# EAGLE design door_lock_2 (EAGLE 7.6.0)
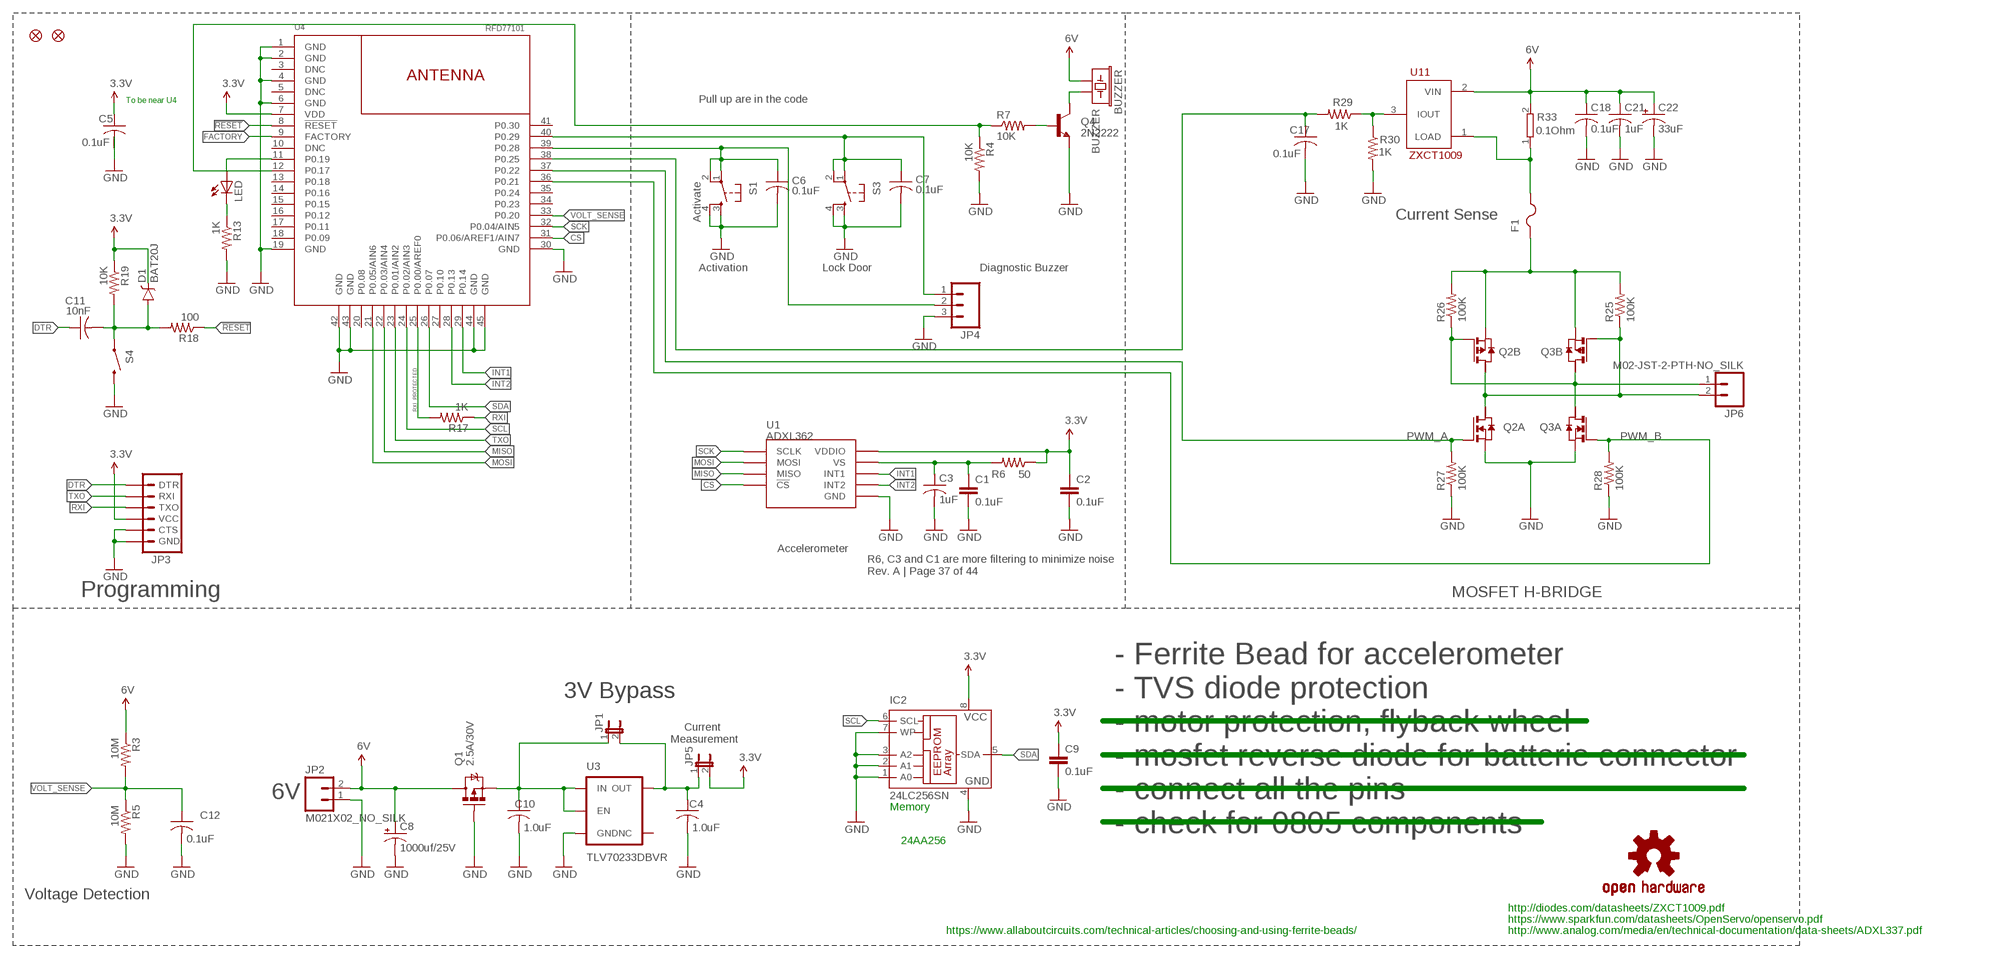
[diagram p0: schematic, sheet 1]

## Parts
BUZZER  BUZZER  BUZZERNS  [BUZZER-12MM-NS]
C1  0.1uF  CAP0805  [0805]
C2  0.1uF  CAP0805  [0805]
C3  1uF  C-USC0805  [C0805]
C4  1.0uF  C-USC0805  [C0805]
C5  0.1uF  C-USC0805  [C0805]
C6  0.1uF  C-USC0805  [C0805]
C7  0.1uF  C-USC0805  [C0805]
C8  1000uf/25V  1000UF-25V(PTH)KIT  [CPOL-RADIAL-1000UF-25V-KIT]
C9  0.1uF  CAP0805  [0805]
C10  1.0uF  C-USC0805  [C0805]
C11  10nF  C-USC0805  [C0805]
C12  0.1uF  C-USC0805  [C0805]
C17  0.1uF  C-USC0805  [C0805]
C18  0.1uF  C-USC0805  [C0805]
C21  1uF  C-USC0805  [C0805]
C22  33uF  CAP_POL3528  [EIA3528]
D1  BAT20J  DIODE-SCHOTTKY-BAT20J  [SOD-323]
F1  PTCFUSE-1812  [1812]
IC2  24LC256SN  [SO-08]
JP1  JUMPER-2SMD-NO  [SJ_2S-NO]
JP2  M021X02_NO_SILK  [1X02_NO_SILK]
JP3  ARDUINO_SERIAL_PROGRAMPTH  [1X06]
JP4  M03PTH  [1X03]
JP5  JUMPER-2PTH  [1X02]
JP6  M02-JST-2-PTH-NO_SILK  [JST-2-PTH-NS]
JP9  FIDUCIALUFIDUCIAL  [MICRO-FIDUCIAL]
JP10  FIDUCIALUFIDUCIAL  [MICRO-FIDUCIAL]
LED  LEDCHIP-LED0805  [CHIP-LED0805]
Q1  2.5A/30V  MOSFET-PCHANNELDMG2307L  [SOT23-3]
Q2  PN_MOSFET-SO8  [SO8]
Q3  PN_MOSFET-SO8  [SO8]
Q4  2N2222  TRANSISTOR_NPNSOT23  [SOT23]
R3  10M  R-US_R0805  [R0805]
R4  10K  R-US_R0805  [R0805]
R5  10M  R-US_R0805  [R0805]
R6  50  R-US_R0805  [R0805]
R7  10K  R-US_R0805  [R0805]
R13  1K  R-US_R0805  [R0805]
R17  1K  R-US_R0805  [R0805]
R18  100  R-US_R0805  [R0805]
R19  10K  R-US_R0805  [R0805]
R25  100K  R-US_R0805  [R0805]
R26  100K  R-US_R0805  [R0805]
R27  100K  R-US_R0805  [R0805]
R28  100K  R-US_R0805  [R0805]
R29  1K  R-US_R0805  [R0805]
R30  1K  R-US_R0805  [R0805]
R33  0.1Ohm  R1206W  [R1206W]
S1  Activate  TAC_SWITCHPTH  [TACTILE-PTH]
S3  TAC_SWITCHPTH  [TACTILE-PTH]
S4  SWITCH-MOMENTARY-2SMD  [TACTILE-SWITCH-SMD]
U1  ADXL362  [ADXL362]
U3  TLV70233DBVR  V_REG_AP2112K-3.3V  [SOT23-5]
U4  RFD77101  [RFD77101]
U11  ZXCT1009  ZCT1009FTA  [SOT23-3]
U$3  OSHW-LOGOS  [OSHW-LOGO-S]

## Nets
3.3V: C2.1 C5.1 C9.1 D1.C IC2.8(VCC) JP3.4(VCC) JP5.2 R6.1 R19.1 U1.P$1(VDDIO) U4.7(VDD)
6V: BUZZER.+ C8.+ C18.1 C21.1 C22.A(+) JP2.2 Q1.3(D) R3.1 R33.2 U11.2(VIN)
!RESET: R18.1 U4.8(!RESET!)
ACTIVATE: C6.1 JP4.2 S1.1 S1.2 U4.39(P0.28)
BUZZER: R4.1 R7.1 U4.12(P0.17)
CS: U1.P$8(!CS) U4.31(P0.06/AREF1/AIN7)
CURSENSE: C17.1 R29.2 U4.38(P0.25)
DTR: C11.1 JP3.1(DTR)
FACTORY: U4.9(FACTORY)
GND: C1.2 C2.2 C3.2 C4.2 C5.2 C6.2 C7.2 C8.- C9.2 C10.2 C12.2 C17.2 C18.2 C21.2 C22.C(-) IC2.1(A0) IC2.2(A1) IC2.3(A2) IC2.4(GND) IC2.7(WP) JP2.1 JP3.5(CTS) JP3.6(GND) JP4.3 Q1.1(G) Q2.1(A:S) Q3.1(A:S) Q4.2(E) R4.2 R5.2 R13.2 R27.1 R28.1 R30.2 S1.3 S1.4 S3.3 S3.4 S4.3 U1.P$12(GND) U1.P$13(GND) U1.P$16(GND) U3.2(GND) U4.1(GND) U4.2(GND) U4.4(GND) U4.6(GND) U4.19(GND) U4.30(GND) U4.42(GND) U4.43(GND) U4.44(GND) U4.45(GND)
INT1: U1.P$11(INT1) U4.29(P0.14)
INT2: U1.P$9(INT2) U4.28(P0.13)
LOCK: C7.1 JP4.1 S3.1 S3.2 U4.40(P0.29)
MISO: U1.P$7(MISO) U4.22(P0.03/AIN4)
MOSI: U1.P$6(MOSI) U4.21(P0.05/AIN6)
MOTOR_OUT_A: JP6.1 Q2.4(B:G) Q3.5(B:D) Q3.7(A:D) R26.1
MOTOR_OUT_B: JP6.2 Q2.5(B:D) Q2.7(A:D) Q3.4(B:G) R25.1
N$2: C4.1 JP1.2 JP5.1 U3.5(OUT)
N$3: F1.2 R33.1 U11.1(LOAD)
N$7: C1.1 C3.1 R6.2 U1.P$14(VS)
N$8: Q4.1(B) R7.2
N$10: BUZZER.- Q4.3(C)
N$13: C11.2 D1.A R18.2 R19.2 S4.1
N$15: LED.C R13.1
N$47: F1.1 Q2.3(B:S) Q3.3(B:S) R25.2 R26.2
N$48: R29.1 R30.1 U11.3(IOUT)
P0.10: LED.A U4.11(P0.19)
PWM_A: Q2.2(A:G) R27.2 U4.37(P0.22)
PWM_B: Q3.2(A:G) R28.2 U4.36(P0.21)
RXI: JP3.3(TXO) R17.1
RXI_PROTECTED: R17.2 U4.25(P0.00/AREF0)
SCK: U1.P$4(SCLK) U4.32(P0.04/AIN5)
SCL: IC2.6(SCL) U4.24(P0.02/AIN3)
SDA: IC2.5(SDA) U4.26(P0.07)
TXO: JP3.2(RXI) U4.23(P0.01/AIN2)
VIN1: C10.1 JP1.1 Q1.2(S) U3.1(IN) U3.3(EN)
VOLT_SENSE: C12.1 R3.2 R5.1 U4.33(P0.20)
Unconnected: Q2.6(B:D2) Q2.8(A:D2) Q3.6(B:D2) Q3.8(A:D2) U3.4(NC) U4.3(DNC) U4.5(DNC) U4.10(DNC) U4.13(P0.18) U4.14(P0.16) U4.15(P0.15) U4.16(P0.12) U4.17(P0.11) U4.18(P0.09) U4.20(P0.08) U4.27(P0.10) U4.34(P0.23) U4.35(P0.24) U4.41(P0.30)

## Notes on the sheet
- To be near U4 | Pull up are in the code
- Current Sense
- Activation | Lock Door | Diagnostic Buzzer
- Accelerometer
- R6, C3 and C1 are more filtering to minimize noise
  Rev. A | Page 37 of 44
- Programming | MOSFET H-BRIDGE
- 3V Bypass
- Current 
  Measurement
- 6V
- Memory
- 24AA256
- Voltage Detection
- - Ferrite Bead for accelerometer
  - TVS diode protection
  - motor protection, flyback wheel
  - mosfet reverse diode for batterie connector
  - connect all the pins
  - check for 0805 components
- http://diodes.com/datasheets/ZXCT1009.pdf
- https://www.sparkfun.com/datasheets/OpenServo/openservo.pdf
- https://www.allaboutcircuits.com/technical-articles/choosing-and-using-ferrite-beads/ | http://www.analog.com/media/en/technical-documentation/data-sheets/ADXL337.pdf

## Library data of the parts
BUZZER = SparkFun-Electromechanical:BUZZER: Buzzer 12mm Spark Fun Electronics SKU : Comp-Buzzer
C1 C2 C9 = SparkFun-Capacitors:CAP: Capacitor Standard 0603 ceramic capacitor, and 0.1" leaded capacitor.
C3-C7 C10-C12 C17 C18 C21 = rcl:C-US: CAPACITOR, American symbol
C8 = SparkFun-Capacitors:1000UF-25V(PTH): CAP-08070; PROD_ID: CAP-09538
C22 = SparkFun:CAP_POL: Capacitor Polarized These are standard SMD and PTH capacitors. Normally 10uF, 47uF, and 100uF in electrolytic and tantalum varieties. Always verify the external diameter of the through hole cap, it varies with capacity, voltage, and manufacturer. The EIA devices should be standard.
D1 = SparkFun-DiscreteSemi:DIODE-SCHOTTKY: Schottky diodes in SFE's production catalog BAT20J 1A 23V 0.62Vf RB751 120mA 40V 0.37Vf PMEG4005EJ 0.5A 40V 0.42Vf MBRA140 1A 40V 0.5Vf B340A 3A 40V SMA; PROD_ID: DIO-11623
F1 = adafruit:PTCFUSE: PTC fuses, resettable thermistors
IC2 = microchip:24*: Serial EEPROM I2C; MF: MICROCHIP; MPN: 24LC256-I/SN; OC_FARNELL: 9757996; OC_NEWARK: 27C9144
JP1 = SparkFun-Retired:JUMPER-2: Jumper Basic 0.1" spaced jumper. Use with breakaway headers.
JP2 JP6 = SparkFun-Connectors:M02: Standard 2-pin 0.1" header. Use with - straight break away headers ( PRT-00116) - right angle break away headers (PRT-00553) - swiss pins (PRT-00743) - machine pins (PRT-00117) - female headers (PRT-00115) Molex polarized connector foot print use with: PRT-08233 with associated crimp pins and housings. 2.54_SCREWTERM for use with PRT-10571. 3.5mm Screw Terminal footprints for PRT-08084 5mm Screw Terminal footprints for use with PRT-08432
JP3 = SparkFun-Connectors:ARDUINO_SERIAL_PROGRAM: FTDI connector footprints
JP4 = SparkFun-Connectors:M03: Header 3 Standard 3-pin 0.1" header. Use with straight break away headers (SKU : PRT-00116), right angle break away headers (PRT-00553), swiss pins (PRT-00743), machine pins (PRT-00117), and female headers (PRT-00115). Molex polarized connector foot print use with SKU : PRT-08232 with associated crimp pins and housings.
JP5 = SparkFun-Passives:JUMPER-2: Jumper Basic 0.1" spaced jumper. Use with breakaway headers.
JP9 JP10 = SparkFun:FIDUCIAL: Fiducial Alignment Points Various fiducial points for machine vision alignment.
LED = adafruit:LED: LED OSRAM: - CHIPLED LG R971, LG N971, LY N971, LG Q971, LY Q971, LO R971, LY R971 LH N974, LH R974 LS Q976, LO Q976, LY Q976 LO Q996 - Hyper CHIPLED LW Q18S LB Q993, LB Q99A, LB R99A - SideLED LS A670, LO A670, LY A670, LG A670, LP A670 LB A673, LV A673, LT A673, LW A673 LH A674 LY A675 LS A676, LA A676, LO A676, LY A676, LW A676 LS A679, LY A679, LG A679 - Hyper Micro SIDELED® LS Y876, LA Y876, LO Y876, LY Y876 LT Y87S - SmartLED LW L88C, LW L88S LB L89C, LB L89S, LG L890 LS L89K, LO L89K, LY L89K LS L896, LA L896, LO L896, LY L896 - TOPLED LS T670, LO T670, LY T670, LG T670, LP T670 LSG T670, LSP T670, LSY T670, LOP T670, LYG T670 LG T671, LOG T671, LSG T671 LB T673, LV T673, LT T673, LW T673 LH T674 LS T676, LA T676, LO T676, LY T676, LB T676, LH T676, LSB T676, LW T676 LB T67C, LV T67C, LT T67C, LS T67K, LO T67K, LY T67K, LW E67C LS E67B, LA E67B, LO E67B, LY E67B, LB E67C, LV E67C, LT E67C LW T67C LS T679, LY T679, LG T679 LS T770, LO T770, LY T770, LG T770, LP T770 LB T773, LV T773, LT T773, LW T773 LH T774 LS E675, LA E675, LY E675, LS T675 LS T776, LA T776, LO T776, LY T776, LB T776 LHGB T686 LT T68C, LB T68C - Hyper Mini TOPLED® LB M676 - Mini TOPLED Santana® LG M470 LS M47K, LO M47K, LY M47K Source: http://www.osram.convergy.de/
Q1 = SparkFun-DiscreteSemi:MOSFET-PCHANNEL: Generic PMOSFET IRLML2244 - TRANS-11153 (SOT-23 -20V -4.3A) (1.Gate 2.Source 3.Drain) FQP27P06 - COM-10349 <http://www.sparkfun.com/products/10349> (TO-220 -60V -27A) (1.Gate 2.Source 3.Drain); PROD_ID: TRANS-11308
Q2 Q3 = zetex:PN_MOSFET-: DUAL N AND P-CHANNEL ENHANCEMENT MODE MOSFET source ZXMD63C02.pdf from http://www.zetex.com/
Q4 = SparkFun-DiscreteSemi:TRANSISTOR_NPN: Generic NPN BJT MMBT2222A - TRANS-08049 (SOT-23, 1A 40V) MPSA42 - TRANS-09116 (SOT-23, 500mA 300V) MMBT5088LT1G - TRANS-11160 (SOT-23, 50 mA 30V) BC547 - COM-08928 <http://www.sparkfun.com/products/8928> (TO-92 45V 100mA) (1.Collector 2.Base 3.Emitter) 2N3904 - COM-00521 <http://www.sparkfun.com/products/521> (TO-92 40V 200mA) (1.Emitter 2.Base 3.Collector) P2N2222A - COM-12852 <http://www.sparkfun.com/products/12852> (TO-92 40V 600mA) (1.Collector 2.Base 3.Emitter)
R3-R7 R13 R17-R19 R25-R30 = rcl:R-US_: RESISTOR, American symbol
R33 = openservo:R1206W
S1 S3 = SparkFun-Electromechanical:TAC_SWITCH: Momentary Switch Button commonly used for reset or general input. Spark Fun Electronics SKU : COM-00097 SMT- SWCH-08247
S4 = SparkFun-Electromechanical:SWITCH-MOMENTARY-2: Various NO switches- pushbuttons, reed, etc
U1 = SparkFun-Sensors:ADXL362: Micropower 3-axis accelerometer 2/4/8g digital output (SPI) IC-11297; PROD_ID: IC-11297
U3 = SparkFun-PowerIC:V_REG_AP2112: AP2112 - 600mA CMOS LDO Regulator w/ Enable The AP2112 is CMOS process low dropout linear regulator with enable function, the regulator delivers a guaranteed 600mA (min.) continuous load current. Features Output Voltage Accuracy: ±1.5% Output Current: 600mA (Min.) Foldback Short Current Protection: 50mA Enable Function to Turn ON/OFF VOUT Low Dropout Voltage (3.3V): 250mV (Typ.) @IOUT=600mA Excellent Load Regulation: 0.2%/A (Typ.) Excellent Line Regulation: 0.02%/V (Typ.) Low Quiescent Current: 55μA (Typ.) Low Standby Current: 0.01μA (Typ.) Low Output Noise: 50μVRMS PSRR: 100Hz -65dB, 1kHz -65dB OTSD Protection Stable with 1.0μF Flexible Cap: Ceramic, Tantalum and Aluminum Electrolytic Operation Temperature Range: -40°C to 85°C ESD: MM 400V, HBM 4000V; PROD_ID: VREG-12457; VALUE: 3.3V
U4 = RFDigital:RFD77101: Simblee ™ BLE Module RFD77101 © 2015 RF Digital Corporation www.RFDigital.com www.Simblee.com PATENTS PENDING 04.01.2015; PROD_ID: COMP-13017
U11 = SparkFun:ZCT1009FTA
U$3 = SparkFun:OSHW-LOGO: Open Source Hardware Logo This logo indicates the piece of hardware it is found on incorporates a OSHW license and/or adheres to the definition of open source hardware found here: http://freedomdefined.org/OSHW

## Net classes
1 vcc: width 0.254 mm

## Board
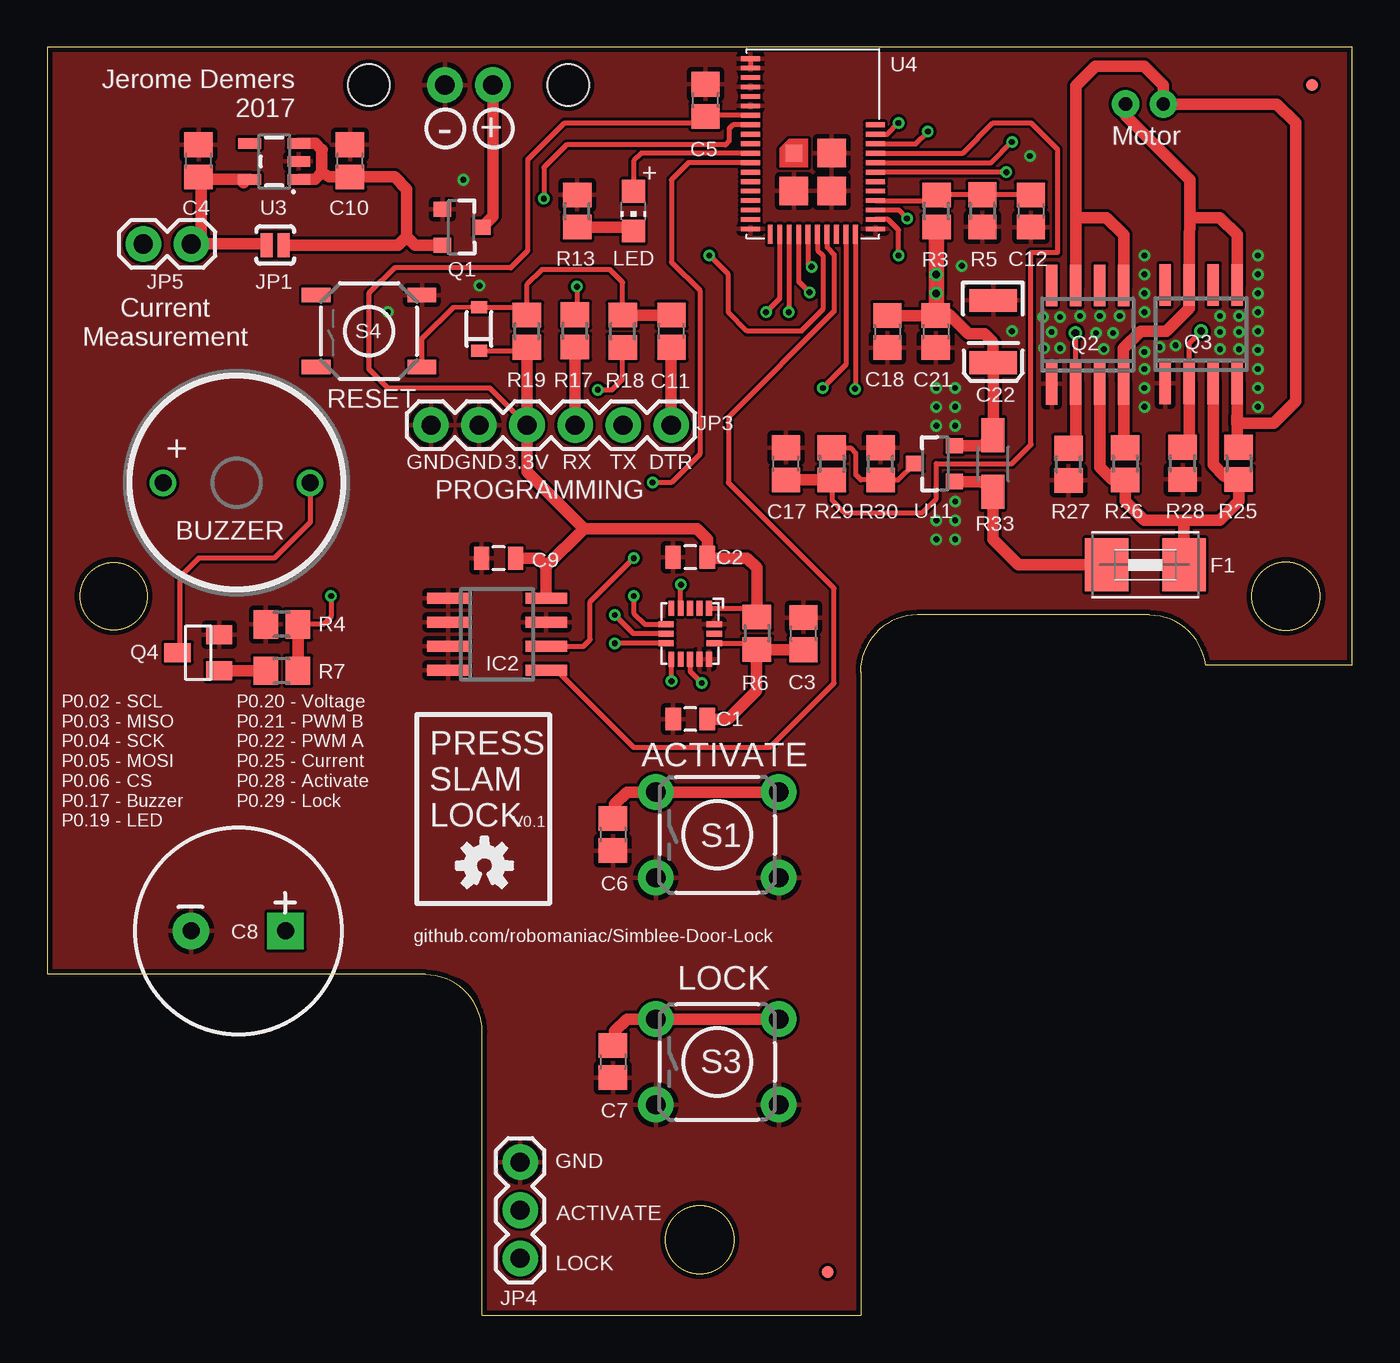
[diagram p1: board, top side]
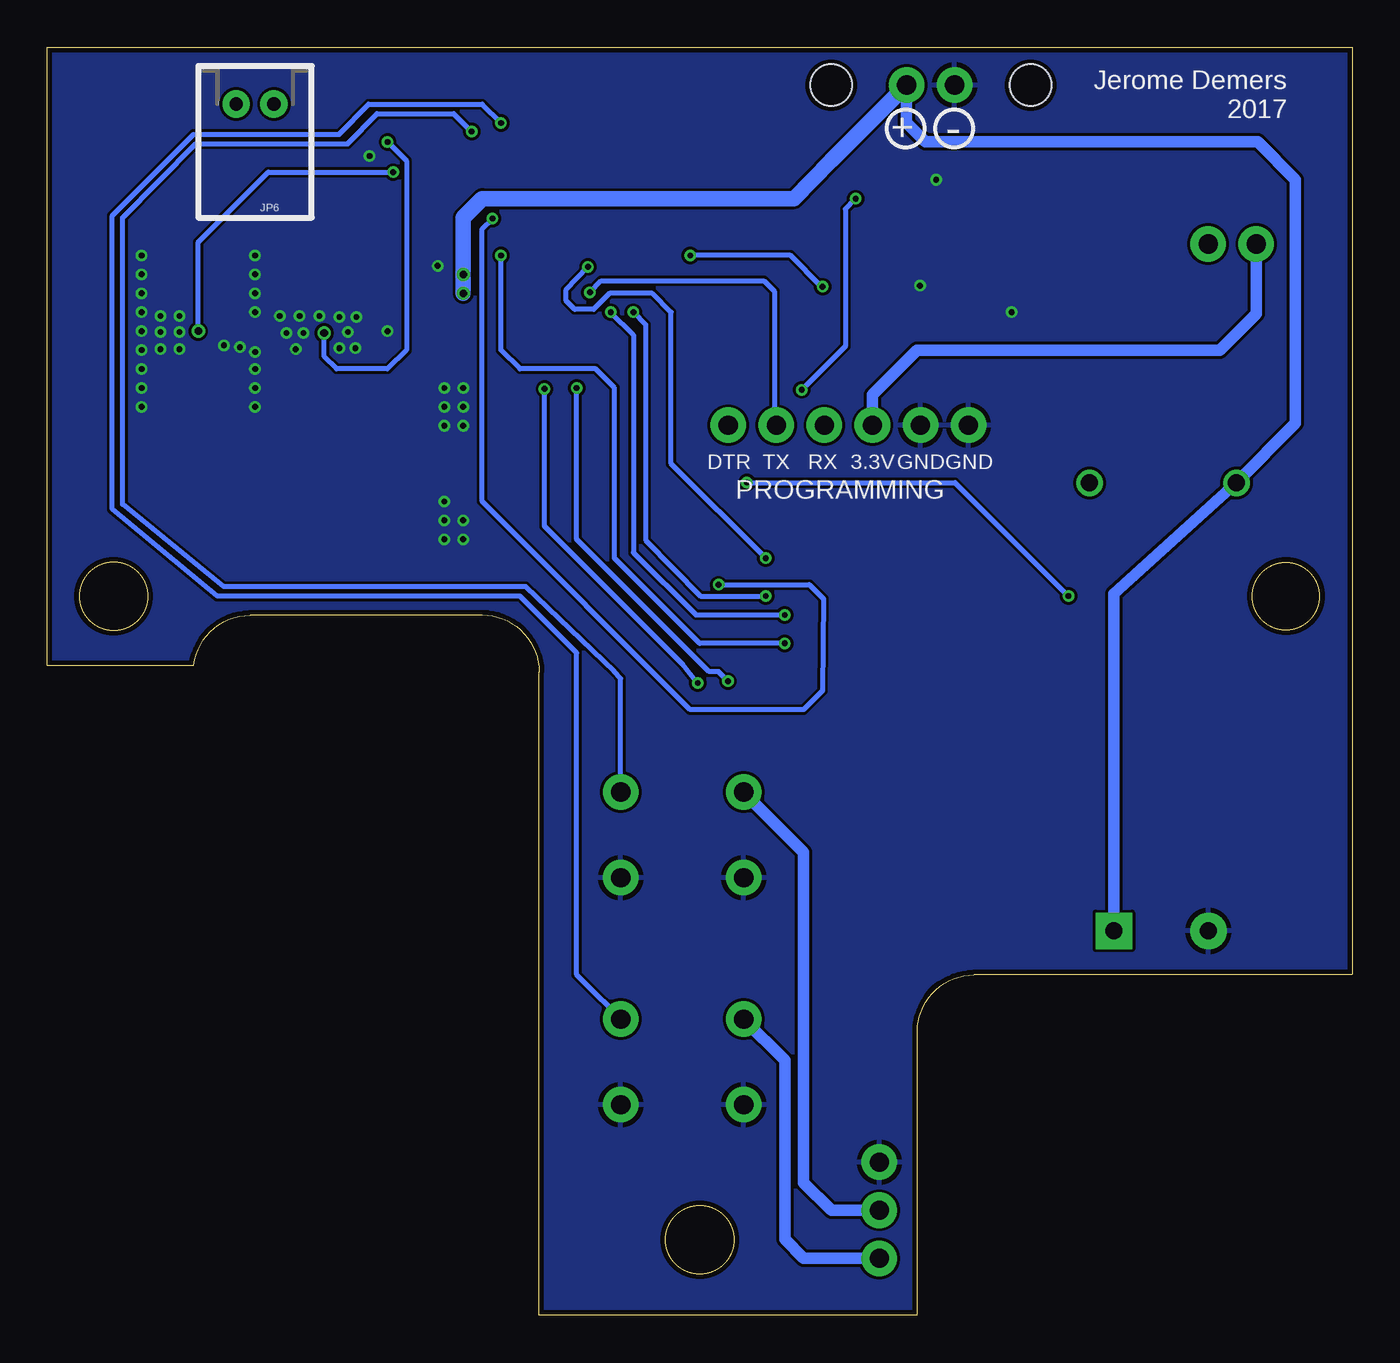
[diagram p2: board, bottom side, seen from below]

Size 68.99 x 67.01 mm. Coordinates in mm from the lower left corner, seen from the top.
Outline: 43,33.99 43,0 22.99,0 22.99,14.99 arc90 19.99,17.98
Outline: 42.99,33.99 arc-90 46,37.01 58.27,37.01
Outline: 58.27,36.99 arc-83 61.24,34.34 68.99,34.34 68.99,67.01 0,67.01 0,18.01 19.99,18.01
Outline: circle at 34.49,3.99 radius 1.8
Outline: circle at 65.48,38 radius 1.8
Outline: circle at 3.51,38 radius 1.78
Copper layers (1*16): Top 0.035mm / dielectric 1.5mm / Bottom 0.035mm
Design rules "SeeedStudio_2layer_DRU_no_angle_20140221": minimum track width 6mil, minimum drill 12mil, track to track 6mil, track to pad 6mil, pad to pad 6mil, via to via 6mil, smd to smd 0mil, copper to edge 10mil, drill to drill 10mil, minimum pad ring 10mil, minimum via ring 6mil, stop-mask expansion 2mil, vias tented up to drill 100mil, thermal gap 10mil
Holes 2.2 mm at 17,65.01 27.55,65.01

### Footprints (pad centres in the part's own frame; a part is rotated, then mirrored left to right if it is on the bottom)
BUZZER-12MM-NS = drill 0.9: + 3.885,0; - -3.885,0
0805 = smd 0.8 x 1.2: 1 -0.9,0; 2 0.9,0
C0805 = smd 1.3 x 1.5: 1 -0.85,0; 2 0.85,0
CPOL-RADIAL-1000UF-25V-KIT = drill 0.9 pad 1.93 square: + 2.5,0 | drill 0.9 pad 1.93: - -2.5,0
EIA3528 = smd 1.2 x 2.5: A 1.65,0; C -1.65,0
SOD-323 = smd 0.63 x 0.83: A 1.15,0; C -1.15,0
1812 = smd 2.286 x 2.794: 1 -2.046,0; 2 2.046,0
SO-08 = smd 0.6 x 2.2: 1 -1.905,-2.6; 2 -0.635,-2.6; 3 0.635,-2.6; 4 1.905,-2.6; 5 1.905,2.6; 6 0.635,2.6; 7 -0.635,2.6; 8 -1.905,2.6
SJ_2S-NO = smd 0.635 x 1.27: 1 -0.45,0; 2 0.45,0
1X02_NO_SILK = drill 1.016 pad 1.88: 1 0,0; 2 2.54,0
1X06 = drill 1.016 pad 1.88: 1 0,0; 2 2.54,0; 3 5.08,0; 4 7.62,0; 5 10.16,0; 6 12.7,0
1X03 = drill 1.016 pad 1.88: 1 0,0; 2 2.54,0; 3 5.08,0
1X02 = drill 1.016 pad 1.88: 1 0,0; 2 2.54,0
JST-2-PTH-NS = drill 0.7 pad 1.448: 1 -1,0; 2 1,0
MICRO-FIDUCIAL = smd 0.635 x 0.635: 1 0,0
CHIP-LED0805 = smd 1.2 x 1.2: A 0,-1.05; C 0,1.05
SOT23-3 = smd 0.8 x 0.9: 1 -0.95,-1; 2 0.95,-1; 3 0,1.1
SO8 = smd 0.6 x 2.2: 1 -1.905,-2.6; 2 -0.635,-2.6; 3 0.635,-2.6; 4 1.905,-2.6; 5 1.905,2.6; 6 0.635,2.6; 7 -0.635,2.6; 8 -1.905,2.6
SOT23 = smd 1 x 1.4: 1 -0.95,-1.1; 2 0.95,-1.1; 3 0,1.1
R0805 = smd 1.3 x 1.5: 1 -0.85,0; 2 0.85,0
R1206W = smd 1.8 x 1.2: 1 -1.499,0; 2 1.499,0
TACTILE-PTH = drill 1.016 pad 1.88: 1 -3.251,2.261; 2 3.251,2.261; 3 -3.251,-2.261; 4 3.251,-2.261
TACTILE-SWITCH-SMD = smd 1.524 x 0.762: 1 -2.794,1.905; 2 2.794,1.905; 3 -2.794,-1.905; 4 2.794,-1.905
ADXL362 = smd 0.8 x 0.3: P$1 -1.35,1; P$2 -1.35,0.5; P$3 -1.35,0; P$4 -1.35,-0.5; P$5 -1.35,-1; P$9 1.35,-1; P$10 1.35,-0.5; P$11 1.35,0; P$12 1.35,0.5; P$13 1.35,1 | smd 0.3 x 0.8: P$6 -0.5,-1.275; P$7 0,-1.275; P$8 0.5,-1.275; P$14 0.5,1.275; P$15 0,1.275; P$16 -0.5,1.275
SOT23-5 = smd 0.55 x 1.2: 1 -0.95,-1.3; 2 0,-1.3; 3 0.95,-1.3; 4 0.95,1.3; 5 -0.95,1.3
RFD77101 = smd 1 x 0.254: 1 0,0; 2 0,-0.5; 3 0,-1; 4 0,-1.5; 5 0,-2; 6 0,-2.5; 7 0,-3; 8 0,-3.5; 9 0,-4; 10 0,-4.5; 11 0,-5; 12 0,-5.5; 13 0,-6; 14 0,-6.5; 15 0,-7; 16 0,-7.5; 17 0,-8; 18 0,-8.5; 19 0,-9; 30 6.61,-9; 31 6.61,-8.5; 32 6.61,-8; 33 6.61,-7.5; 34 6.61,-7; 35 6.61,-6.5; 36 6.61,-6; 37 6.61,-5.5; 38 6.61,-5; 39 6.61,-4.5; 40 6.61,-4; 41 6.61,-3.5 | smd 0.254 x 1: 20 1.055,-9.29; 21 1.555,-9.29; 22 2.055,-9.29; 23 2.555,-9.29; 24 3.055,-9.29; 25 3.555,-9.29; 26 4.055,-9.29; 27 4.555,-9.29; 28 5.055,-9.29; 29 5.555,-9.29 | smd 0.9 x 0.9: 42 2.3,-4.99 | smd 1.5 x 1.5: 43 2.3,-6.99; 44 4.3,-6.99; 45 4.3,-4.99

### Placement (x,y rotation side)
BUZZER  10,43.98 180 top
C1  33.99,31.5 180 top
C2  33.99,40.05 180 top
C3  39.98,36.02 90 top
C4  8,61.01 90 top
C5  34.8,64.21 90 top
C6  29.9,25.41 270 top
C7  29.9,13.41 270 top
C8  10.1,20.31 0 top
C9  23.85,40.01 180 top
C10  16,61.01 90 top
C11  33,52.01 90 top
C12  52,58.36 270 top
C17  39.05,44.99 90 top
C18  44.41,51.98 270 top
C21  46.97,51.99 270 top
C22  50.01,51.98 270 top
D1  22.82,52.11 90 top
F1  58.05,39.66 180 top
IC2  23.78,35.99 270 top
JP1  12.05,56.56 180 top
JP2  21.02,65.01 0 top
JP3  32.98,47.04 180 top
JP4  25,3.01 90 top
JP5  7.61,56.61 180 top
JP6  58,64.01 180 bottom
JP9  66.85,65.02 180 top
JP10  41.25,2.27 270 top
LED  30.99,58.35 180 top
Q1  21.89,57.5 270 top
Q2  55,51.82 0 top
Q3  61,51.85 0 top
Q4  7.99,35.01 90 top
R3  47.01,58.35 90 top
R4  12.4,36.51 180 top
R5  49.44,58.36 270 top
R6  37.51,36.04 270 top
R7  12.4,34.06 180 top
R13  28.01,58.35 90 top
R17  27.9,52.02 90 top
R18  30.42,52 90 top
R19  25.36,52 90 top
R25  62.98,45.02 270 top
R26  56.98,44.99 270 top
R27  53.99,44.97 90 top
R28  60.02,45.02 90 top
R29  41.48,44.99 270 top
R30  44.05,44.99 90 top
R33  49.99,45.01 90 top
S1  35.42,25.39 0 top
S3  35.42,13.38 0 top
S4  17.01,52.01 180 top
U1  33.98,36.02 270 top
U3  12,60.97 90 top
U4  37.16,66.41 0 top
U11  46.94,45.01 90 top
U$3  23.11,23.76 0 top

### Tracks (layer width: path | path; a pad name or v marks a point on that pad's centre or on a via)
3.3V
  Top 0.254: U4.7 34.85,63.41 C5.1 34.35,63.36 35,63.01 27.35,63.01 25.4,61.06 25.4,56.26 24.5,55.36 18.35,55.36 17,54.01 17,50.01 18,49.01 23.39,49.01 JP3.4 | U1.P$1 37.04,37.37 R6.1 | 25.06,51.45 R19.1 25.16,50.96 D1.C
  Top 0.61: R19.1 JP3.4 25.36,44.56 28.36,41.56 | R6.1 37.51,39.49 37,40.01 34.89,40.01 C2.1 34.9,40.01 34.9,41.01 34.34,41.56 28.36,41.56 | IC2.8 26.38,39.58 | 26.38,39.58 25.95,40.01 C9.1 | 28.36,41.56 26.38,39.58
  Bottom 0.61: JP5.2 5.07,52.93 7,51.01 23,51.01 25.36,48.64 JP3.4
6V  (via drill 0.4)
  Top 0.406: 23,57.52 Q1.3
  Top 0.61: U11.2 49.44,45.96 R33.2 50.01,46.52 C22.A 50,51.41 49.55,51.86 48.7,51.86 47.68,52.88 47.01,52.88 C21.1 C18.1 | JP2.2 23.56,60.01 | 23.56,60.01 23.56,58.08 Q1.3 | 23.57,59.99 23.56,60.01
  Top 0.813: R3.1 47.01,55.02 | 47.01,55.02 v47,55.01 47.01,54.99 | 47.01,52.88 47.01,54.02 | 47.01,55.02 47.01,54.99 | 47.01,54.99 47.01,54.02 | 47.01,54.02 v47,54.01
  Bottom 0.61: JP2.2 23.56,63.01 22.56,62.01 5,62.01 3,60.01 3,47.14 BUZZER.+ 12.6,38.14 C8.+
  Bottom 0.813: JP2.2 27.57,61.01 29.5,59.01 46,59.01 47,58.01 v47,55.01 v47,54.01
!RESET  (via drill 0.3)
  Top 0.254: U4.8 36.25,62.91 36.05,62.71 36.05,62.06 35.85,61.86 27.45,61.86 26.25,60.66 v26.25,59.01 | v29.1,48.91 29.85,48.91 30.4,49.46 30.4,51.13 R18.1
  Bottom 0.254: v29.1,48.91 26.8,51.21 26.8,58.46 v26.25,59.01
ACTIVATE  (via drill 0.3)
  Top 0.254: U4.39 45.9,61.91 v46.55,62.56
  Top 0.61: S1.2 S1.1 30.64,27.65 30,27.01 30,26.36 C6.1
  Bottom 0.254: v46.55,62.56 47.5,63.51 51.55,63.51 53.1,61.91 61.15,61.91 65,58.01 65,42.86 59.65,38.51 43.7,38.51 39.01,34 38.67,33.66 S1.2
  Bottom 0.61: JP4.2 27.54,5.55 29,7.01 29,24.48 S1.1
BUZZER  (via drill 0.3)
  Top 0.254: U4.12 33.9,60.91 33,60.01 33,55.66 34.5,54.16 34.5,45.51 33,44.01 v32,44.01 | v15,38.01 15,36.91 14.6,36.51 R4.1
  Top 0.61: R7.1 R4.1
  Bottom 0.254: v32,44.01 21,44.01 v15,38.01
CS  (via drill 0.3)
  Top 0.254: U1.P$8 31.01,35.52 v30,35.51 | v45,56.01 45,57.36 44.45,57.91 U4.31
  Bottom 0.254: v30,35.51 34.5,35.51 39,40.01 39,49.01 40,50.01 44,50.01 45,51.01 v45,56.01
CURSENSE
  Top 0.254: U4.38 48.4,61.41 50,63.01 52,63.01 53.4,61.61 53.4,56.16 52,56.16 52,46.01 51,45.01 47,45.01 47,43.16 46.25,42.41 42.15,42.41 41.5,43.06 41.5,44.12 R29.2
  Top 0.61: R29.2 C17.1
DTR
  Top 0.61: JP3.1 32.98,51.14 C11.1
GND  (via drill 0.3)
  Top 0.254: U4.1 U4.2
  other vias: 55.65,52.81 54.6,52.81 56.35,51.91 59.65,51.26 62,52.81 63,52.81 63,51.96 62,51.96 63,51.06 62,51.06 56.7,52.81 55.85,51.06 53.1,51.96 55.45,51.91 53.55,51.11 64,53.01 64,52.01 64,51.01 58,50.01 58,49.01 58,50.91 58,53.01 58,54.01 58,55.01 58,56.01 51.95,61.26 51,52.01 64,54.01 64,55.01 64,56.01 48.35,55.46 22,60.01 22.85,54.41 18,53.01 58,48.01 64,50.01 64,49.01 64,48.01 53.55,52.76 52.65,52.76 52.7,51.11 58.8,51.16 47,47.01 47,48.01 48,43.01 48,42.01 48,41.01 48,47.01 48,48.01 48,49.01 47,41.01 47,42.01 47,49.01
  pour Bottom: 0,67.01 69,67.01 69,34.01 61,34.01 arc90 58,37.01 57,37.01 46,37.01 arc90 43,34.01 43,33.01 43,0.01 23,0.01 23,16.01 arc90 21,18.01 20,18.01 0,18.01
  pour Top (isolate 0.012): 0,67.01 69,67.01 69,34.01 61,34.01 61,35.01 arc90 59,37.01 58,37.01 46,37.01 arc90 43,34.01 43,0.01 23,0.01 23,16.01 arc90 21,18.01 20,18.01 0,18.01
INT1  (via drill 0.3)
  Top 0.254: U1.P$11 33.98,34.02 v34.6,33.41 | U4.29 42.72,48.98 v42.7,48.96
  Bottom 0.254: v34.6,33.41 35.4,34.41 42.7,41.71 v42.7,48.96
INT2  (via drill 0.3)
  Top 0.254: U1.P$9 32.98,33.52 v33,33.51 | U4.28 42.22,50.23 v41,49.01
  Bottom 0.254: v33,33.51 33.5,34.01 34,34.01 41,41.01 v41,49.01
LOCK  (via drill 0.3)
  Top 0.254: U4.40 44.4,62.41 v45,63.01
  Top 0.61: S3.2 S3.1 30.64,15.65 30,15.01 30,14.36 C7.1
  Bottom 0.254: S3.2 38.24,15.25 41,18.01 41,35.01 44,38.01 60,38.01 65.55,42.61 65.55,58.11 61.25,62.41 53.55,62.41 52,64.01 46,64.01 v45,63.01
  Bottom 0.61: JP4.1 29,3.01 30,4.01 30,13.48 S3.1
MISO  (via drill 0.3)
  Top 0.254: U1.P$7 30.99,36.02 v30,37.01 | U4.22 39.22,53.03 v39.2,53.01
  Bottom 0.254: v39.2,53.01 38,51.81 38,40.31 34.7,37.01 v30,37.01
MOSI  (via drill 0.3)
  Top 0.254: v31,38.01 31,37.11 31.6,36.51 32.7,36.51 U1.P$6 | U4.21 38.72,53.73 v38,53.01
  Bottom 0.254: v38,53.01 37.35,52.36 37.35,40.96 34.45,38.01 v31,38.01
MOTOR_OUT_A
  Top 0.61: R26.1 56.91,45.92 Q2.4 56.9,49.43 56.9,51.11 57.8,52.01 59.15,52.01 60.37,53.22 Q3.7 60.37,56.64 60.4,58.01 | 60.4,58.01 60.4,60.01 57,63.41 JP6.1 | Q3.5 62.91,57.1 62,58.01 60.4,58.01
MOTOR_OUT_B
  Top 0.61: Q3.4 62.91,48.01 | 62.91,48.01 62.91,45.95 R25.1 | Q2.7 54.37,58.01 | 54.37,58.01 54.37,64.97 55.4,66.01 58,66.01 59,65.01 JP6.2 65,64.01 66,63.01 66,48.31 64.84,47.15 62.9,47.15 62.91,48.01 | Q2.5 56.91,57.1 56,58.01 54.37,58.01
N$2
  Top 0.61: U3.5 10.2,60.02 | 10.2,60.02 8.13,60.02 | 8.13,60.02 C4.1 | 10.38,59.85 10.2,60.02 | 8.13,60.02 8.13,57.13 JP5.1 11.54,56.61 JP1.2
N$3
  Top 0.61: U11.1 49.44,44.06 R33.1 50,41.01 51.35,39.66 F1.2
N$7
  Top 0.254: U1.P$14 37.19,35.52 R6.2
  Top 0.61: C3.1 37.54,35.17 R6.2 37.5,33.01 36,31.5 C1.1
N$8
  Top 0.61: Q4.1 R7.2
N$10
  Top 0.254: BUZZER.- 13.9,41.91 12,40.01 8,40.01 7,39.01 7,35.12 Q4.3
  Top 0.61: 7.02,35.15 Q4.3 6.75,35.14
N$13
  Top 0.254: R19.2 24.95,53.26 D1.A 21.45,53.25 19.8,51.61 S4.1 | R18.2 30.42,54.58 29.75,55.26 26.15,55.26 25.35,54.46 R19.2
  Top 0.61: C11.2 R18.2 | R19.2
N$15
  Top 0.254: 31.11,57.5 LED.C
  Top 0.61: 31.11,57.5 R13.1
N$47
  Top 0.406: R26.2 57.02,43.89 | 55.7,49.36 Q2.3 | 61.55,49.31 Q3.3 | R25.2 62.81,44.34
  Top 0.61: 62.81,44.34 62.22,44.34 61.65,44.96 61.65,49.36 Q3.3 | Q2.3 55.65,49.41 55.65,44.81 56.31,44.14 R26.2 56.98,43.02 58,42.01 60,42.01 | 60,42.01 62,42.01 63,43.01 63,44.15 R25.2 | F1.1 60.1,41.91 60,42.01
N$48
  Top 0.254: U11.3 44.98,44.14 R30.1 43.01,44.14 42.75,44.41 42.75,45.56 42.5,45.81 41.51,45.81 R29.1
P0.10
  Top 0.254: U4.11 31.4,61.41 31,61.01 31,60.06 LED.A
PWM_A  (via drill 0.3, 0.4)
  Top 0.254: U4.37 49.9,60.91 v51,62.01 | v54.35,51.91 54.35,49.44 Q2.2
  Top 0.61: Q2.2 54.37,46.2 R27.2
  Bottom 0.254: v51,62.01 50,61.01 50,51.01 51,50.01 53.7,50.01 54.35,50.66 v54.35,51.91
PWM_B  (via drill 0.3, 0.4)
  Top 0.254: Q3.2 60.37,51.37 v61,52.01 | v50.7,60.41 U4.36
  Top 0.61: Q3.2 60.37,46.21 R28.2
  Bottom 0.254: v61,52.01 61,56.71 57.3,60.41 v50.7,60.41
RXI
  Top 0.61: JP3.3 R17.1
RXI_PROTECTED  (via drill 0.3)
  Top 0.254: U4.25 40.72,56.29 41,56.01 41,53.16 39.85,52.01 37,52.01 36,53.01 36,55.01 v35,56.01 | v28,54.36 28,52.98 R17.2
  Bottom 0.254: v28,54.36 28.05,54.36 29.7,56.01 v35,56.01
SCK  (via drill 0.3)
  Top 0.254: U1.P$4 33.48,38.49 v33.5,38.61 | U4.32 45,58.41 v45.45,57.96
  Bottom 0.254: v45.45,57.96 46,57.41 46,43.01 35,32.01 29,32.01 28,33.01 27.95,37.86 28.7,38.61 v33.5,38.61
SCL  (via drill 0.3)
  Top 0.254: U4.24 40.22,55.54 v40.4,55.41 | IC2.6 28.35,35.35 28.7,35.71 28.7,37.71 v31,40.01
  Bottom 0.254: v31,40.01 36,45.01 36,53.01 37,54.01 39.25,54.01 40.1,53.16 41.1,53.16 41.55,53.61 41.55,54.21 v40.4,55.41
SDA
  Top 0.254: U4.26 41.22,56.44 41.6,56.06 41.6,53.06 36,47.46 36,44.01 41.6,38.41 41.6,33.41 38.2,30.01 31,30.01 26.92,34.08 IC2.5
TXO  (via drill 0.3)
  Top 0.254: U4.23 39.72,54.64 v40.3,54.06
  Bottom 0.254: v40.3,54.06 39.7,54.66 31.1,54.66 30.55,54.11 30.55,47.14 JP3.2
VIN1
  Top 0.406: 13.35,60.03 U3.1 | 14.53,61.58 14.45,61.66
  Top 0.61: Q1.2 19.45,56.55 19,57.01 | 19,57.01 18.55,56.56 JP1.1 | U3.3 14.18,61.92 14.45,61.66 14.5,61.61 | 13.35,60.03 14.17,60.03 14.5,60.41 | 14.5,60.41 14.5,61.61 | 14.5,61.61 14.53,61.58 | 19,57.01 19,59.51 18.35,60.16 C10.1 14.9,60.16 14.5,60.41
VOLT_SENSE
  Top 0.254: U4.33 46.96,58.91 R3.2 R5.1 49.53,59.21 C12.1
  Top 0.61: 47.47,58.81 R3.2

### Text on the board
tNames: Jerome Demers / 2017 | - | + | Motor | Current / Measurement | RESET | + | GND | GND | 3.3V | RX | TX | DTR | PROGRAMMING | P0.02 - SCL / P0.03 - MISO / P0.04 - SCK / P0.05 - MOSI / P0.06 - CS / P0.17 - Buzzer / P0.19 - LED | P0.20 - Voltage / P0.21 - PWM B / P0.22 - PWM A / P0.25 - Current / P0.28 - Activate / P0.29 - Lock | ACTIVATE | PRESS / SLAM / LOCK | V0.1 | github.com/robomaniac/Simblee-Door-Lock | LOCK | GND | ACTIVATE | LOCK
bNames: Jerome Demers / 2017 | - | + | GND | GND | 3.3V | RX | TX | DTR | PROGRAMMING